# EAGLE schematic STM32f103 (EAGLE 9.5.1)

## Sheet 1 of 7: STM32F103C8TU
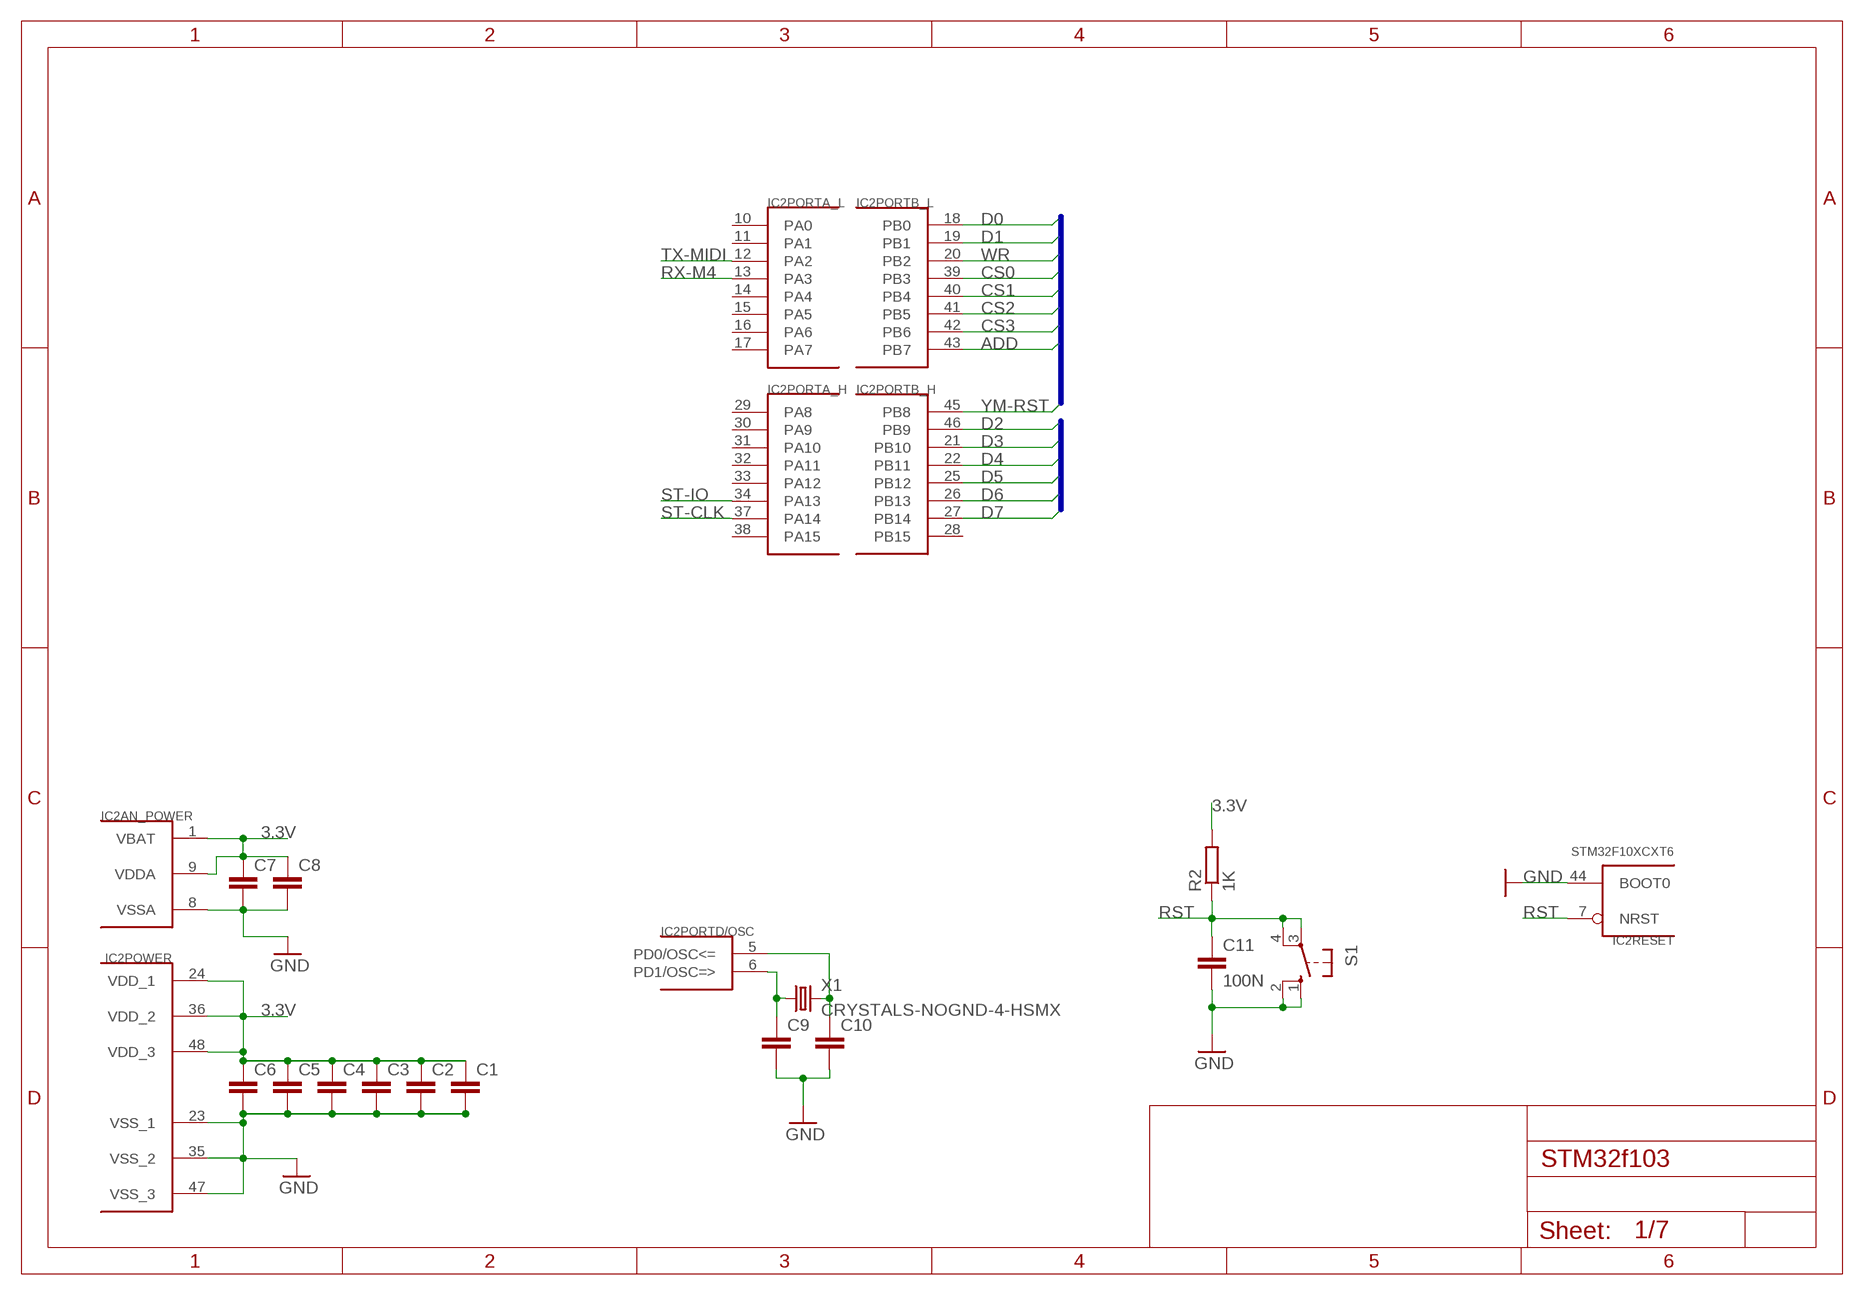
[diagram p0: schematic, sheet 1]

### Parts
C1  C-EUC0603  [C0603]
C2  C-EUC0603  [C0603]
C3  C-EUC0603  [C0603]
C4  C-EUC0603  [C0603]
C5  C-EUC0603  [C0603]
C6  C-EUC0603  [C0603]
C7  C-EUC0603  [C0603]
C8  C-EUC0603  [C0603]
C9  C-EUC0603  [C0603]
C10  C-EUC0603  [C0603]
C11  100N  [0603-SMD]
IC2  STM32F10XCXT6  [TQFP48]
R2  1K  [0805-SMD]
S1  10-XX  [B3F-10XX]
X1  CRYSTALS-NOGND-4-HSMX  [HC49-4-HSMX]

### Nets
3.3V: C1.1 C2.1 C3.1 C4.1 C5.1 C6.1 C7.1 C8.1 IC2.1(AN_POWER:VBAT) IC2.9(AN_POWER:VDDA) IC2.24(POWER:VDD_1) IC2.36(POWER:VDD_2) IC2.48(POWER:VDD_3) R2.2 ; also sheet 6
ADD: IC2.43(PORTB_L:PB7) ; also sheet 2,3,4,5
CS0: IC2.39(PORTB_L:PB3) ; also sheet 2
CS1: IC2.40(PORTB_L:PB4) ; also sheet 3
CS2: IC2.41(PORTB_L:PB5) ; also sheet 4
CS3: IC2.42(PORTB_L:PB6) ; also sheet 5
D0: IC2.18(PORTB_L:PB0) ; also sheet 2,3,4,5
D1: IC2.19(PORTB_L:PB1) ; also sheet 2,3,4,5
D2: IC2.46(PORTB_H:PB9) ; also sheet 2,3,4,5
D3: IC2.21(PORTB_H:PB10) ; also sheet 2,3,4,5
D4: IC2.22(PORTB_H:PB11) ; also sheet 2,3,4,5
D5: IC2.25(PORTB_H:PB12) ; also sheet 2,3,4,5
D6: IC2.26(PORTB_H:PB13) ; also sheet 2,3,4,5
D7: IC2.27(PORTB_H:PB14) ; also sheet 2,3,4,5
GND: C1.2 C2.2 C3.2 C4.2 C5.2 C6.2 C7.2 C8.2 C9.2 C10.2 C11.2 IC2.8(AN_POWER:VSSA) IC2.23(POWER:VSS_1) IC2.35(POWER:VSS_2) IC2.44(RESET:BOOT0) IC2.47(POWER:VSS_3) S1.1(S) S1.2(S1) ; also sheet 2,3,4,5,6
N$1: C9.1 IC2.6(PORTD/OSC:PD1/OSC=>) X1.1
N$2: C10.1 IC2.5(PORTD/OSC:PD0/OSC<=) X1.2
RST: C11.1 IC2.7(RESET:NRST) R2.1 S1.3(P) S1.4(P1)
RX-M4: IC2.13(PORTA_L:PA3)
ST-CLK: IC2.37(PORTA_H:PA14)
ST-IO: IC2.34(PORTA_H:PA13)
TX-MIDI: IC2.12(PORTA_L:PA2)
WR: IC2.20(PORTB_L:PB2) ; also sheet 2,3,4,5
YM-RST: IC2.45(PORTB_H:PB8) ; also sheet 2,3,4,5
Unconnected: IC2.2(PORTC:PC13) IC2.3(PORTC:PC14) IC2.4(PORTC:PC15) IC2.10(PORTA_L:PA0) IC2.11(PORTA_L:PA1) IC2.14(PORTA_L:PA4) IC2.15(PORTA_L:PA5) IC2.16(PORTA_L:PA6) IC2.17(PORTA_L:PA7) IC2.28(PORTB_H:PB15) IC2.29(PORTA_H:PA8) IC2.30(PORTA_H:PA9) IC2.31(PORTA_H:PA10) IC2.32(PORTA_H:PA11) IC2.33(PORTA_H:PA12) IC2.38(PORTA_H:PA15)

### Buses
ADD,CS0,CS1,CS2,CS3,D0,D1,WR,YM-RST
B$2

## Sheet 2 of 7: YM3812-0
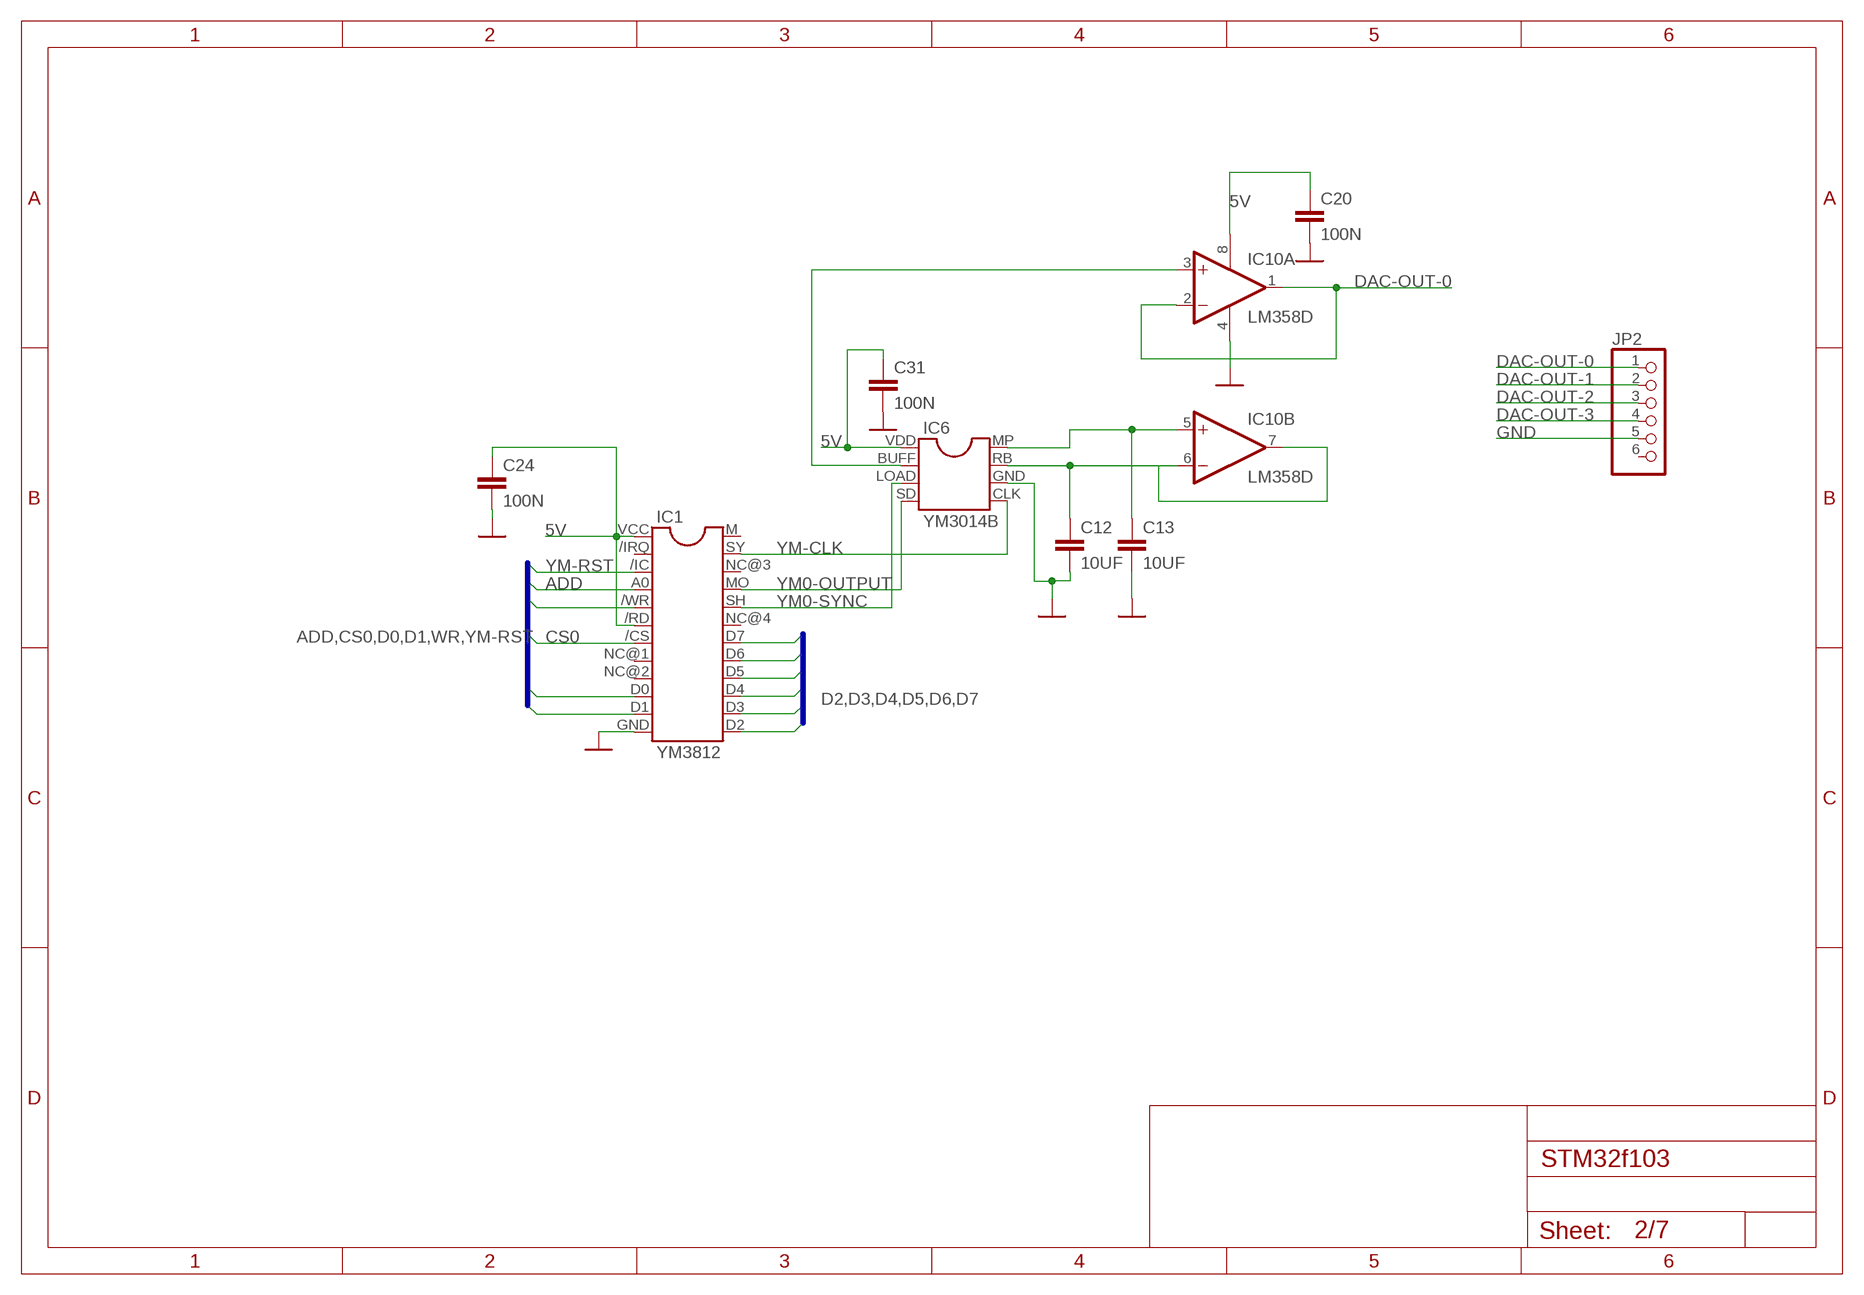
[diagram p1: schematic, sheet 2]

### Parts
C12  10UF  [0603-SMD]
C13  10UF  [0603-SMD]
C20  100N  [0603-SMD]
C24  100N  [0603-SMD]
C31  100N  [0603-SMD]
IC1  YM3812  [YM3812]
IC6  YM3014B  [YM3014B]
IC10  LM358D  [SO08]
JP2  PINHD-1X6  [1X06]

### Nets
5V: C20.1 C24.1 C31.1 IC1./RD IC1.VCC IC6.VDD IC10.8(P:V+) ; also sheet 3,4,5,6
ADD: IC1.A0 ; also sheet 1,3,4,5
CS0: IC1./CS ; also sheet 1
D0: IC1.D0 ; also sheet 1,3,4,5
D1: IC1.D1 ; also sheet 1,3,4,5
D2: IC1.D2 ; also sheet 1,3,4,5
D3: IC1.D3 ; also sheet 1,3,4,5
D4: IC1.D4 ; also sheet 1,3,4,5
D5: IC1.D5 ; also sheet 1,3,4,5
D6: IC1.D6 ; also sheet 1,3,4,5
D7: IC1.D7 ; also sheet 1,3,4,5
DAC-OUT-0: IC10.1(A:OUT) IC10.2(A:-IN) JP2.1
DAC-OUT-1: JP2.2 ; also sheet 3
DAC-OUT-2: JP2.3 ; also sheet 4
DAC-OUT-3: JP2.4 ; also sheet 5
GND: C12.2 C13.2 C20.2 C24.2 C31.2 IC1.GND IC6.GND IC10.4(P:V-) JP2.5 ; also sheet 1,3,4,5,6
N$3: IC6.BUFF IC10.3(A:+IN)
N$4: C13.1 IC6.MP IC10.5(B:+IN)
N$5: C12.1 IC6.RB IC10.6(B:-IN) IC10.7(B:OUT)
WR: IC1./WR ; also sheet 1,3,4,5
YM0-OUTPUT: IC1.MO IC6.SD
YM0-SYNC: IC1.SH IC6.LOAD
YM-CLK: IC1.SY IC6.CLK ; also sheet 3,4,5
YM-RST: IC1./IC ; also sheet 1,3,4,5
Unconnected: IC1./IRQ IC1.M IC1.NC@1(NC) IC1.NC@2(NC) IC1.NC@3(NC) IC1.NC@4(NC) JP2.6

### Buses
ADD,CS0,D0,D1,WR,YM-RST
D2,D3,D4,D5,D6,D7

## Sheet 3 of 7: YM3812-1
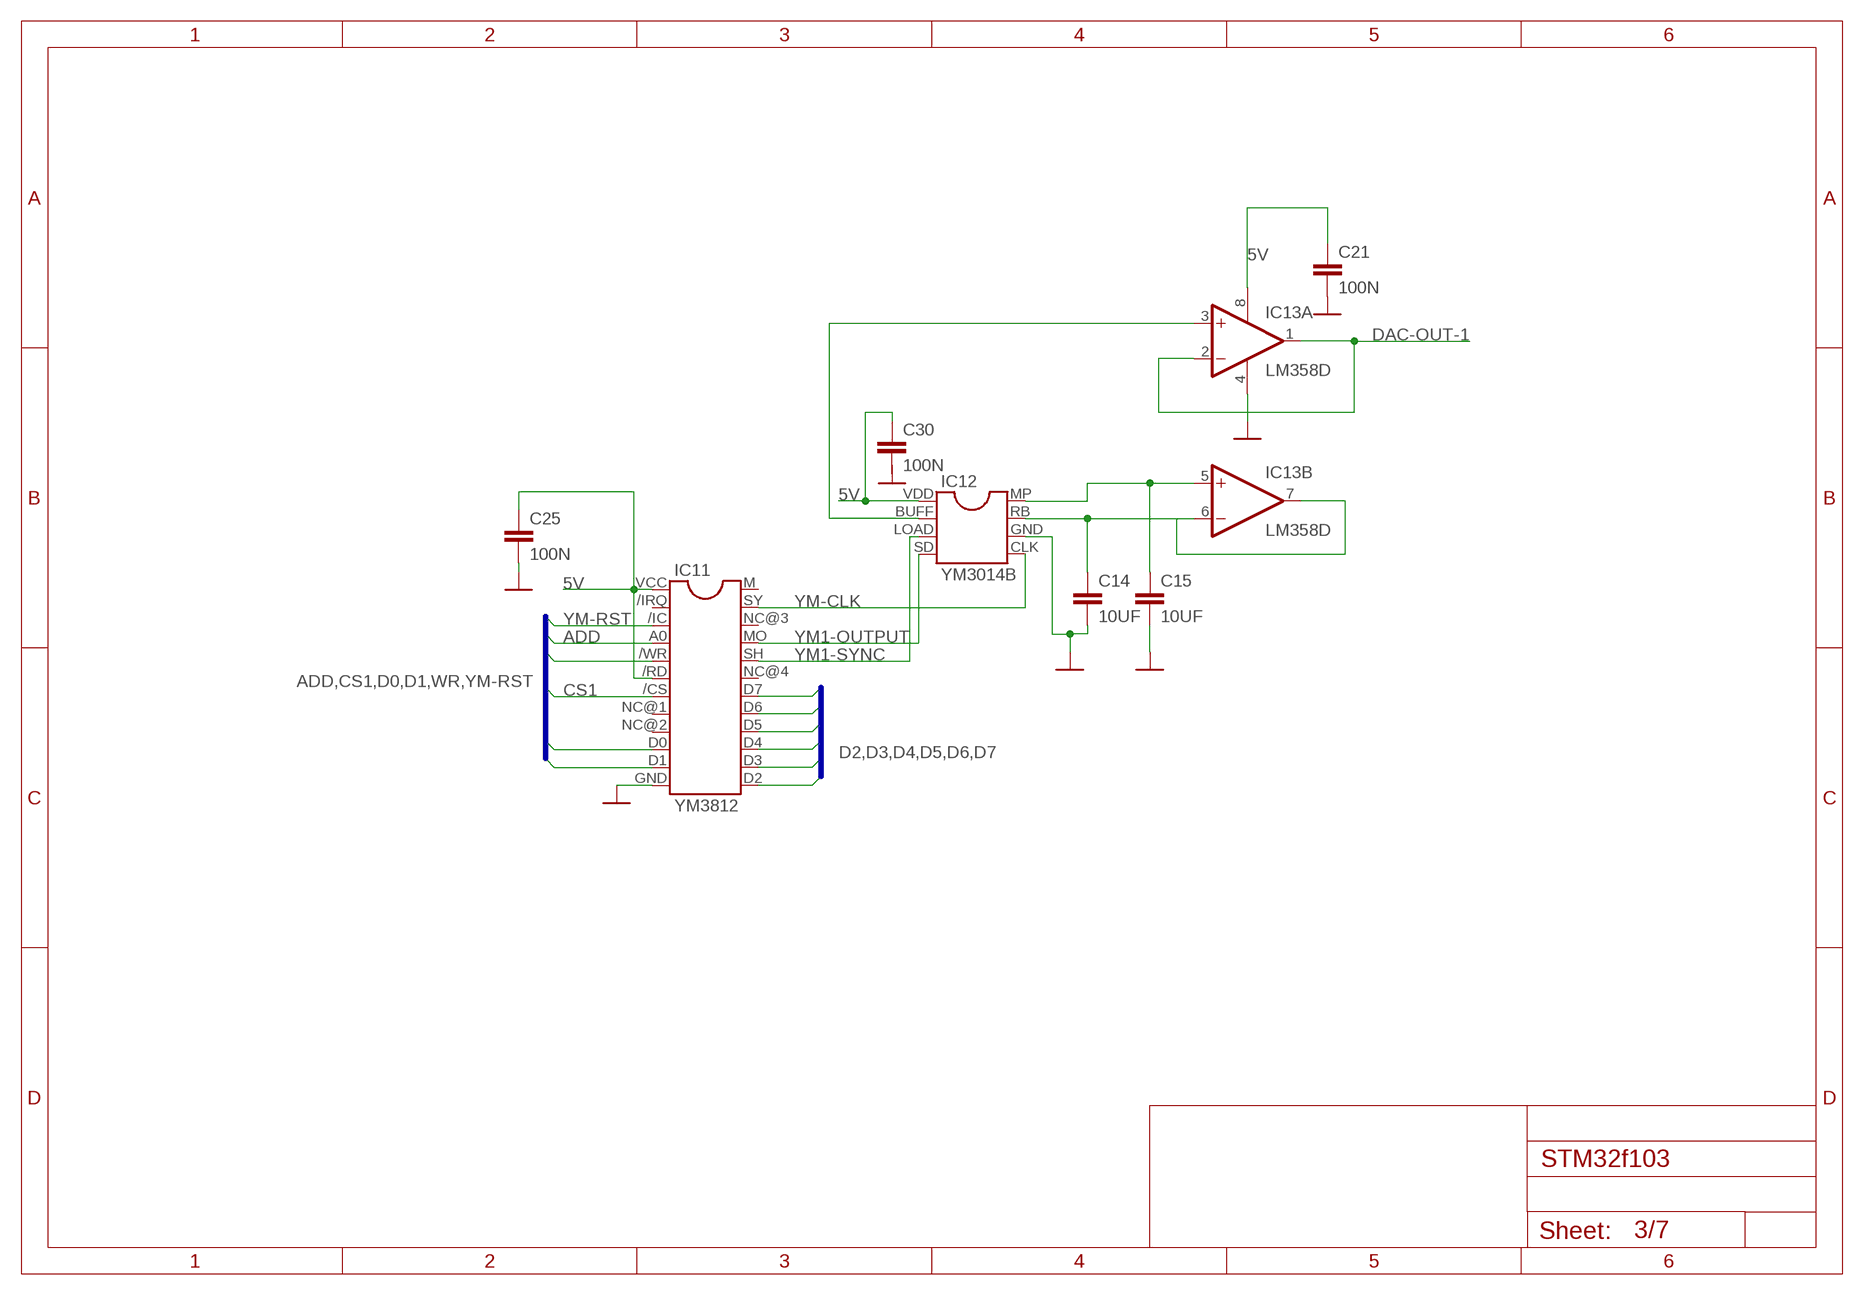
[diagram p2: schematic, sheet 3]

### Parts
C14  10UF  [0603-SMD]
C15  10UF  [0603-SMD]
C21  100N  [0603-SMD]
C25  100N  [0603-SMD]
C30  100N  [0603-SMD]
IC11  YM3812  [YM3812]
IC12  YM3014B  [YM3014B]
IC13  LM358D  [SO08]

### Nets
5V: C21.1 C25.1 C30.1 IC11./RD IC11.VCC IC12.VDD IC13.8(P:V+) ; also sheet 2,4,5,6
ADD: IC11.A0 ; also sheet 1,2,4,5
CS1: IC11./CS ; also sheet 1
D0: IC11.D0 ; also sheet 1,2,4,5
D1: IC11.D1 ; also sheet 1,2,4,5
D2: IC11.D2 ; also sheet 1,2,4,5
D3: IC11.D3 ; also sheet 1,2,4,5
D4: IC11.D4 ; also sheet 1,2,4,5
D5: IC11.D5 ; also sheet 1,2,4,5
D6: IC11.D6 ; also sheet 1,2,4,5
D7: IC11.D7 ; also sheet 1,2,4,5
DAC-OUT-1: IC13.1(A:OUT) IC13.2(A:-IN) ; also sheet 2
GND: C14.2 C15.2 C21.2 C25.2 IC11.GND IC12.GND IC13.4(P:V-) ; also sheet 1,2,4,5,6
N$6: IC12.BUFF IC13.3(A:+IN)
N$7: C15.1 IC12.MP IC13.5(B:+IN)
N$8: C14.1 IC12.RB IC13.6(B:-IN) IC13.7(B:OUT)
WR: IC11./WR ; also sheet 1,2,4,5
YM1-OUTPUT: IC11.MO IC12.SD
YM1-SYNC: IC11.SH IC12.LOAD
YM-CLK: IC11.SY IC12.CLK ; also sheet 2,4,5
YM-RST: IC11./IC ; also sheet 1,2,4,5
Unconnected: C30.2 IC11./IRQ IC11.M IC11.NC@1(NC) IC11.NC@2(NC) IC11.NC@3(NC) IC11.NC@4(NC)

### Buses
D2,D3,D4,D5,D6,D7
ADD,CS1,D0,D1,WR,YM-RST

## Sheet 4 of 7: YM3812-2
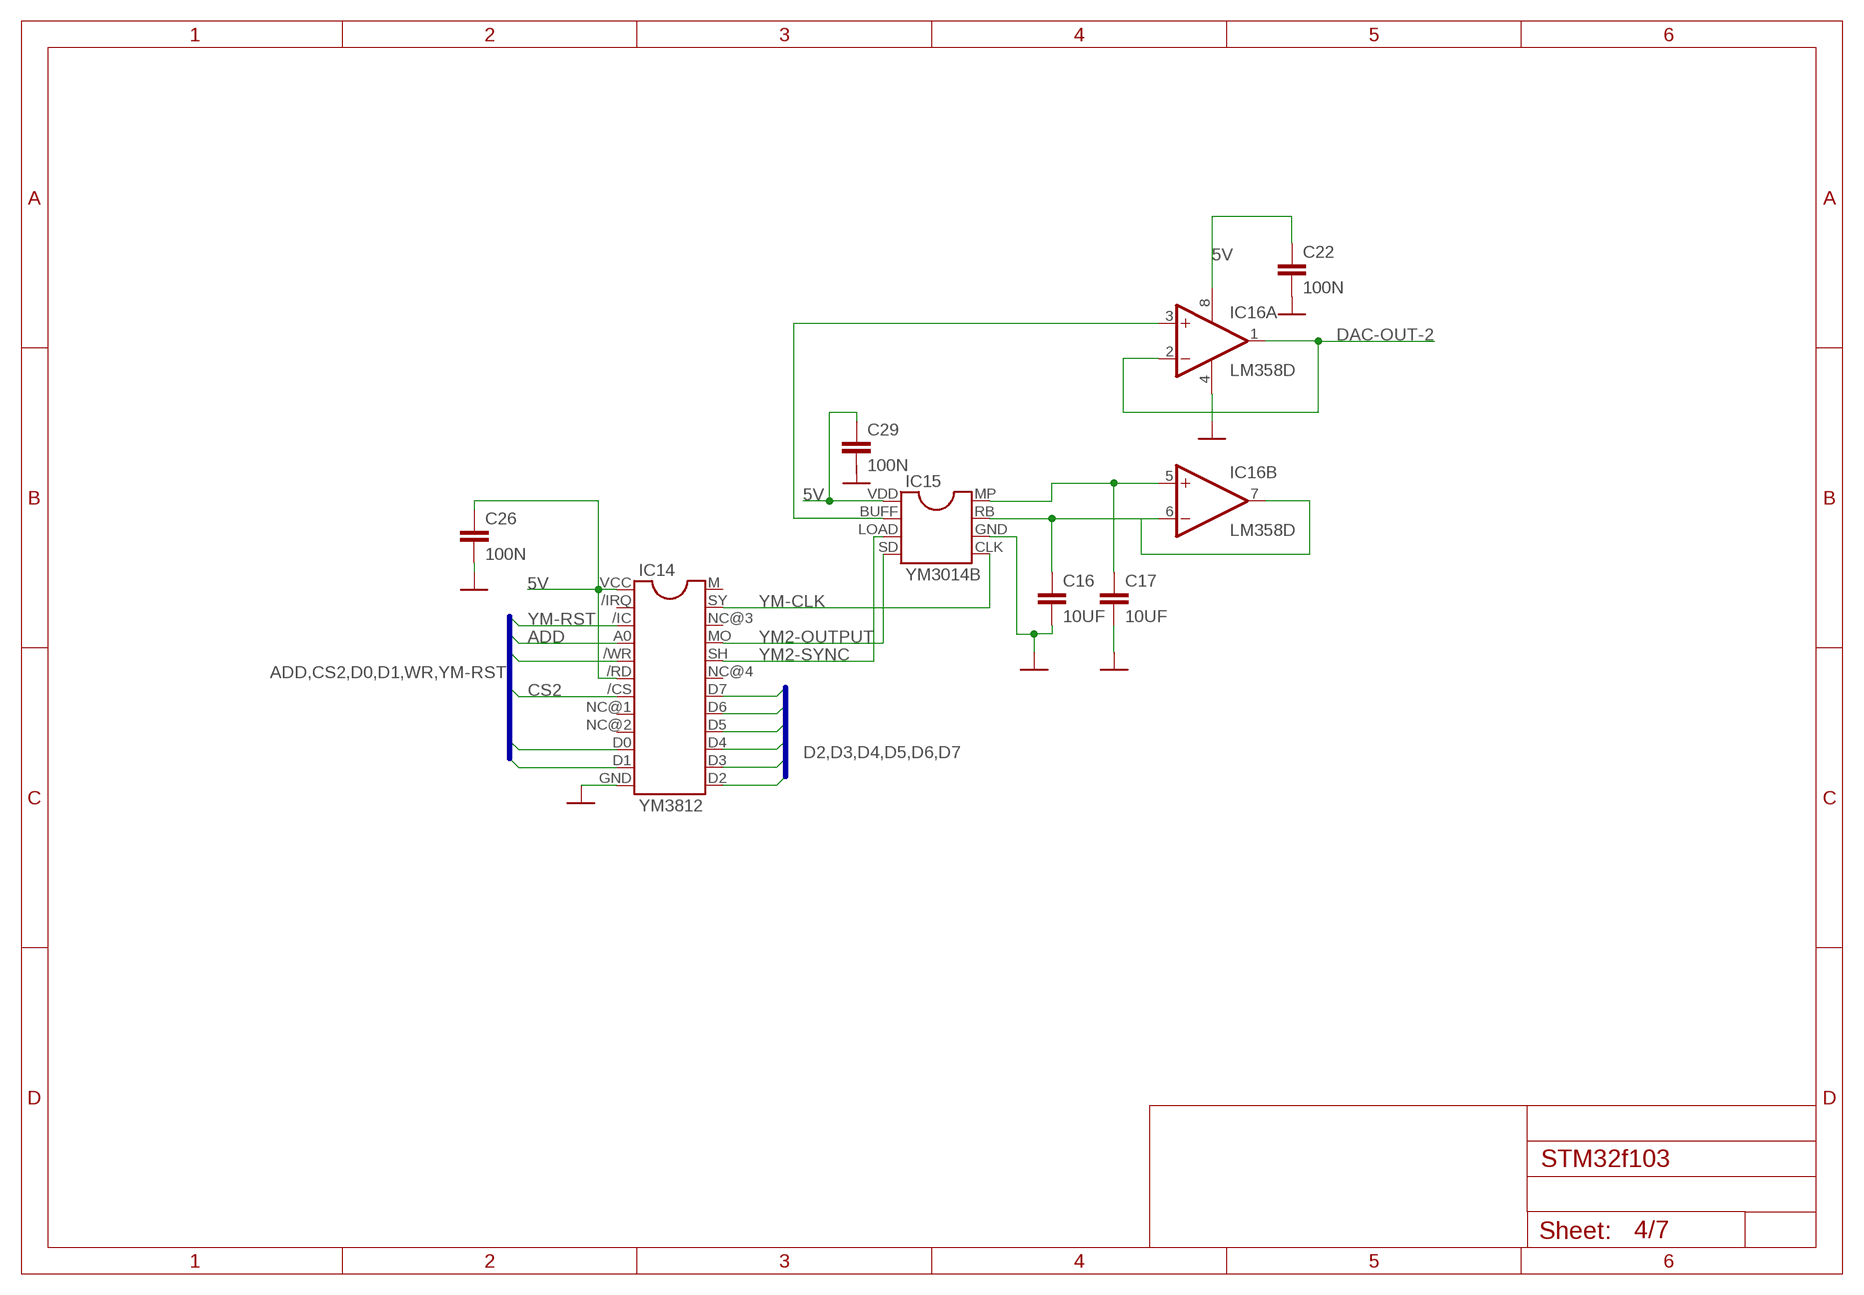
[diagram p3: schematic, sheet 4]

### Parts
C16  10UF  [0603-SMD]
C17  10UF  [0603-SMD]
C22  100N  [0603-SMD]
C26  100N  [0603-SMD]
C29  100N  [0603-SMD]
IC14  YM3812  [YM3812]
IC15  YM3014B  [YM3014B]
IC16  LM358D  [SO08]

### Nets
5V: C22.1 C26.1 C29.1 IC14./RD IC14.VCC IC15.VDD IC16.8(P:V+) ; also sheet 2,3,5,6
ADD: IC14.A0 ; also sheet 1,2,3,5
CS2: IC14./CS ; also sheet 1
D0: IC14.D0 ; also sheet 1,2,3,5
D1: IC14.D1 ; also sheet 1,2,3,5
D2: IC14.D2 ; also sheet 1,2,3,5
D3: IC14.D3 ; also sheet 1,2,3,5
D4: IC14.D4 ; also sheet 1,2,3,5
D5: IC14.D5 ; also sheet 1,2,3,5
D6: IC14.D6 ; also sheet 1,2,3,5
D7: IC14.D7 ; also sheet 1,2,3,5
DAC-OUT-2: IC16.1(A:OUT) IC16.2(A:-IN) ; also sheet 2
GND: C16.2 C17.2 C22.2 C26.2 IC14.GND IC15.GND IC16.4(P:V-) ; also sheet 1,2,3,5,6
N$9: IC15.BUFF IC16.3(A:+IN)
N$10: C17.1 IC15.MP IC16.5(B:+IN)
N$11: C16.1 IC15.RB IC16.6(B:-IN) IC16.7(B:OUT)
WR: IC14./WR ; also sheet 1,2,3,5
YM2-OUTPUT: IC14.MO IC15.SD
YM2-SYNC: IC14.SH IC15.LOAD
YM-CLK: IC14.SY IC15.CLK ; also sheet 2,3,5
YM-RST: IC14./IC ; also sheet 1,2,3,5
Unconnected: C29.2 IC14./IRQ IC14.M IC14.NC@1(NC) IC14.NC@2(NC) IC14.NC@3(NC) IC14.NC@4(NC)

### Buses
D2,D3,D4,D5,D6,D7
ADD,CS2,D0,D1,WR,YM-RST

## Sheet 5 of 7: YM3812-3
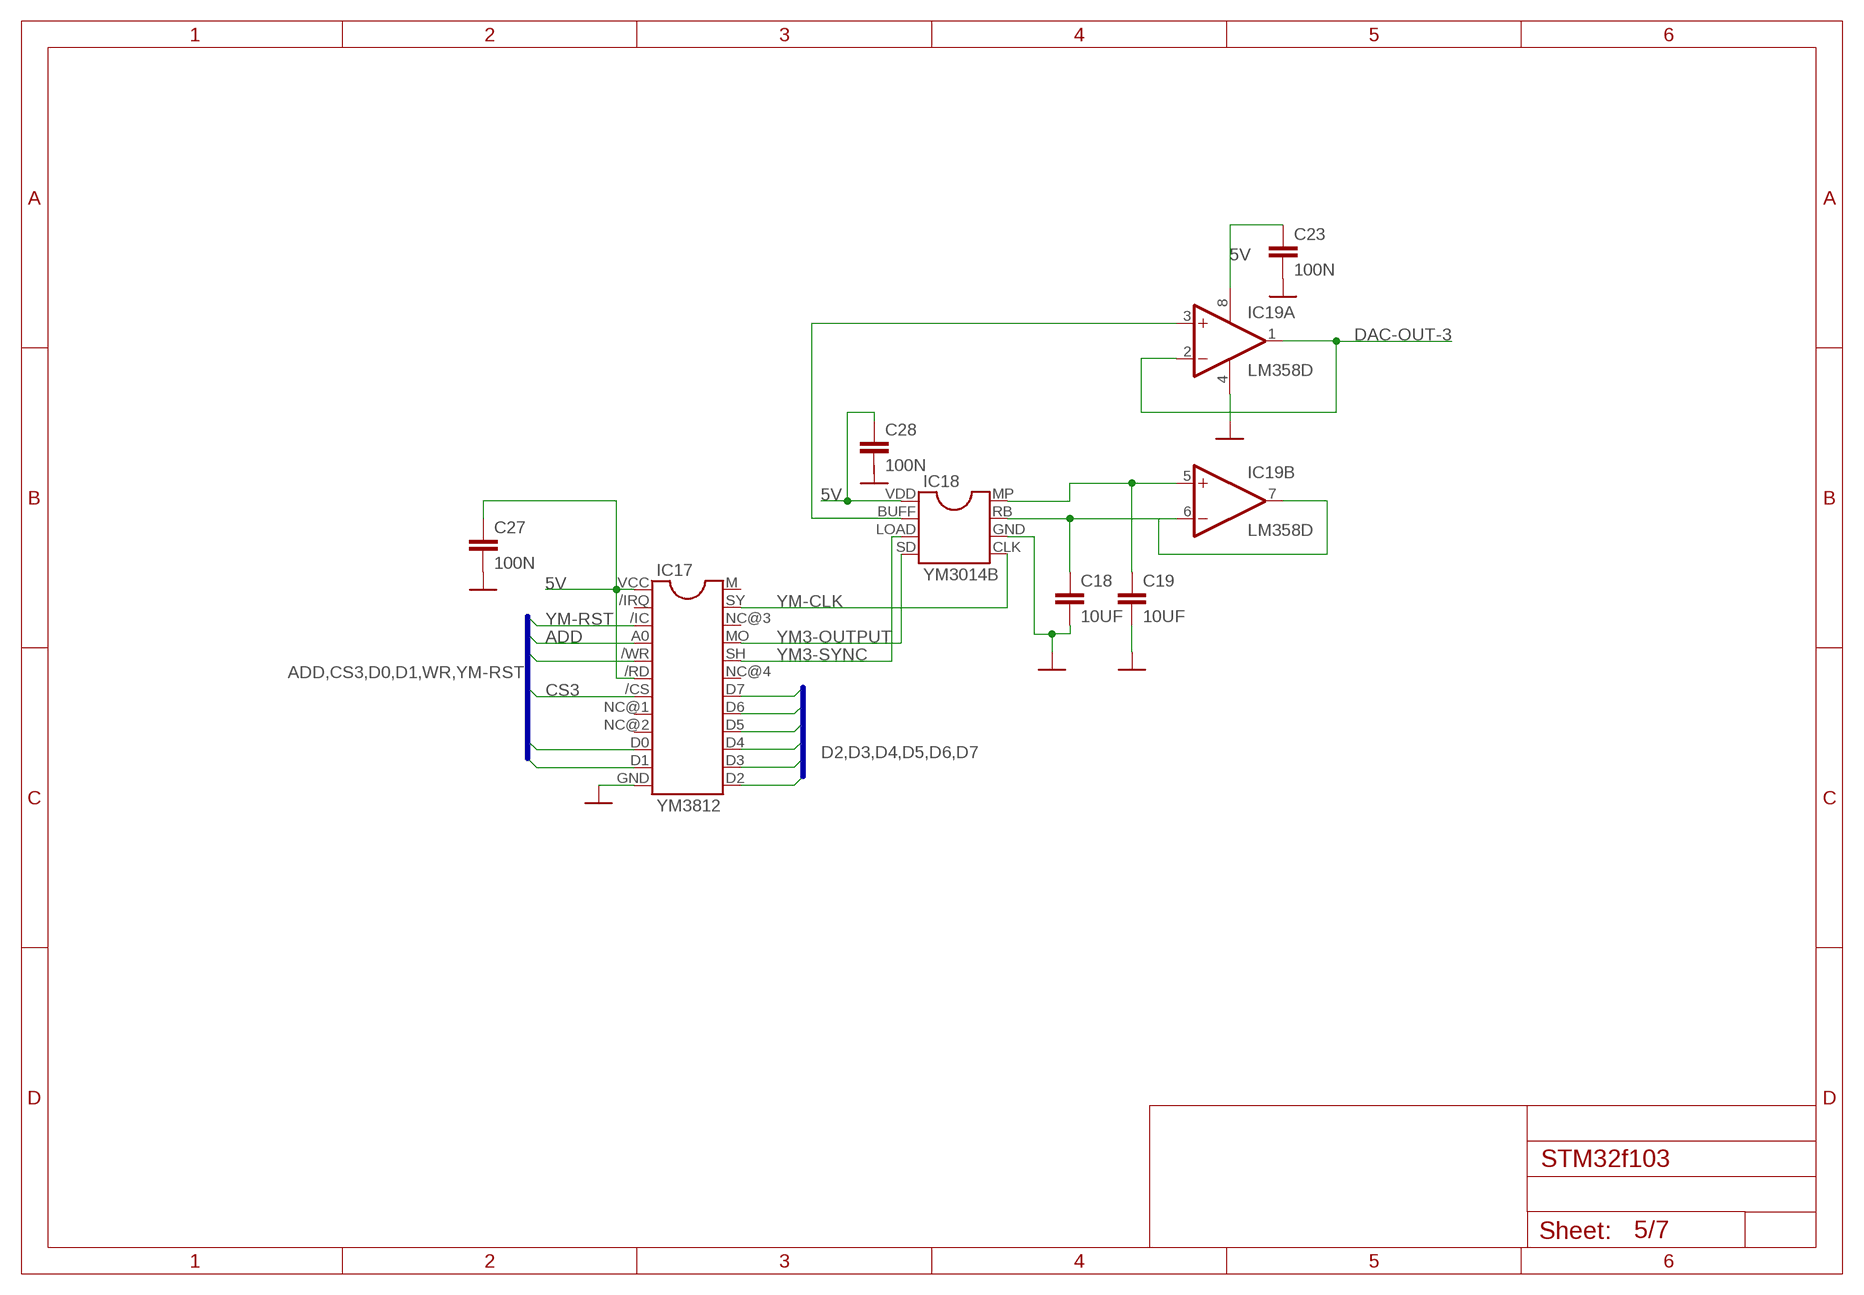
[diagram p4: schematic, sheet 5]

### Parts
C18  10UF  [0603-SMD]
C19  10UF  [0603-SMD]
C23  100N  [0603-SMD]
C27  100N  [0603-SMD]
C28  100N  [0603-SMD]
IC17  YM3812  [YM3812]
IC18  YM3014B  [YM3014B]
IC19  LM358D  [SO08]

### Nets
5V: C23.1 C27.1 C28.1 IC17./RD IC17.VCC IC18.VDD IC19.8(P:V+) ; also sheet 2,3,4,6
ADD: IC17.A0 ; also sheet 1,2,3,4
CS3: IC17./CS ; also sheet 1
D0: IC17.D0 ; also sheet 1,2,3,4
D1: IC17.D1 ; also sheet 1,2,3,4
D2: IC17.D2 ; also sheet 1,2,3,4
D3: IC17.D3 ; also sheet 1,2,3,4
D4: IC17.D4 ; also sheet 1,2,3,4
D5: IC17.D5 ; also sheet 1,2,3,4
D6: IC17.D6 ; also sheet 1,2,3,4
D7: IC17.D7 ; also sheet 1,2,3,4
DAC-OUT-3: IC19.1(A:OUT) IC19.2(A:-IN) ; also sheet 2
GND: C18.2 C19.2 C23.2 C27.2 IC17.GND IC18.GND IC19.4(P:V-) ; also sheet 1,2,3,4,6
N$12: IC18.BUFF IC19.3(A:+IN)
N$13: C19.1 IC18.MP IC19.5(B:+IN)
N$14: C18.1 IC18.RB IC19.6(B:-IN) IC19.7(B:OUT)
WR: IC17./WR ; also sheet 1,2,3,4
YM3-OUTPUT: IC17.MO IC18.SD
YM3-SYNC: IC17.SH IC18.LOAD
YM-CLK: IC17.SY IC18.CLK ; also sheet 2,3,4
YM-RST: IC17./IC ; also sheet 1,2,3,4
Unconnected: C28.2 IC17./IRQ IC17.M IC17.NC@1(NC) IC17.NC@2(NC) IC17.NC@3(NC) IC17.NC@4(NC)

### Buses
D2,D3,D4,D5,D6,D7
ADD,CS3,D0,D1,WR,YM-RST

## Sheet 6 of 7: POWER SUPPLY
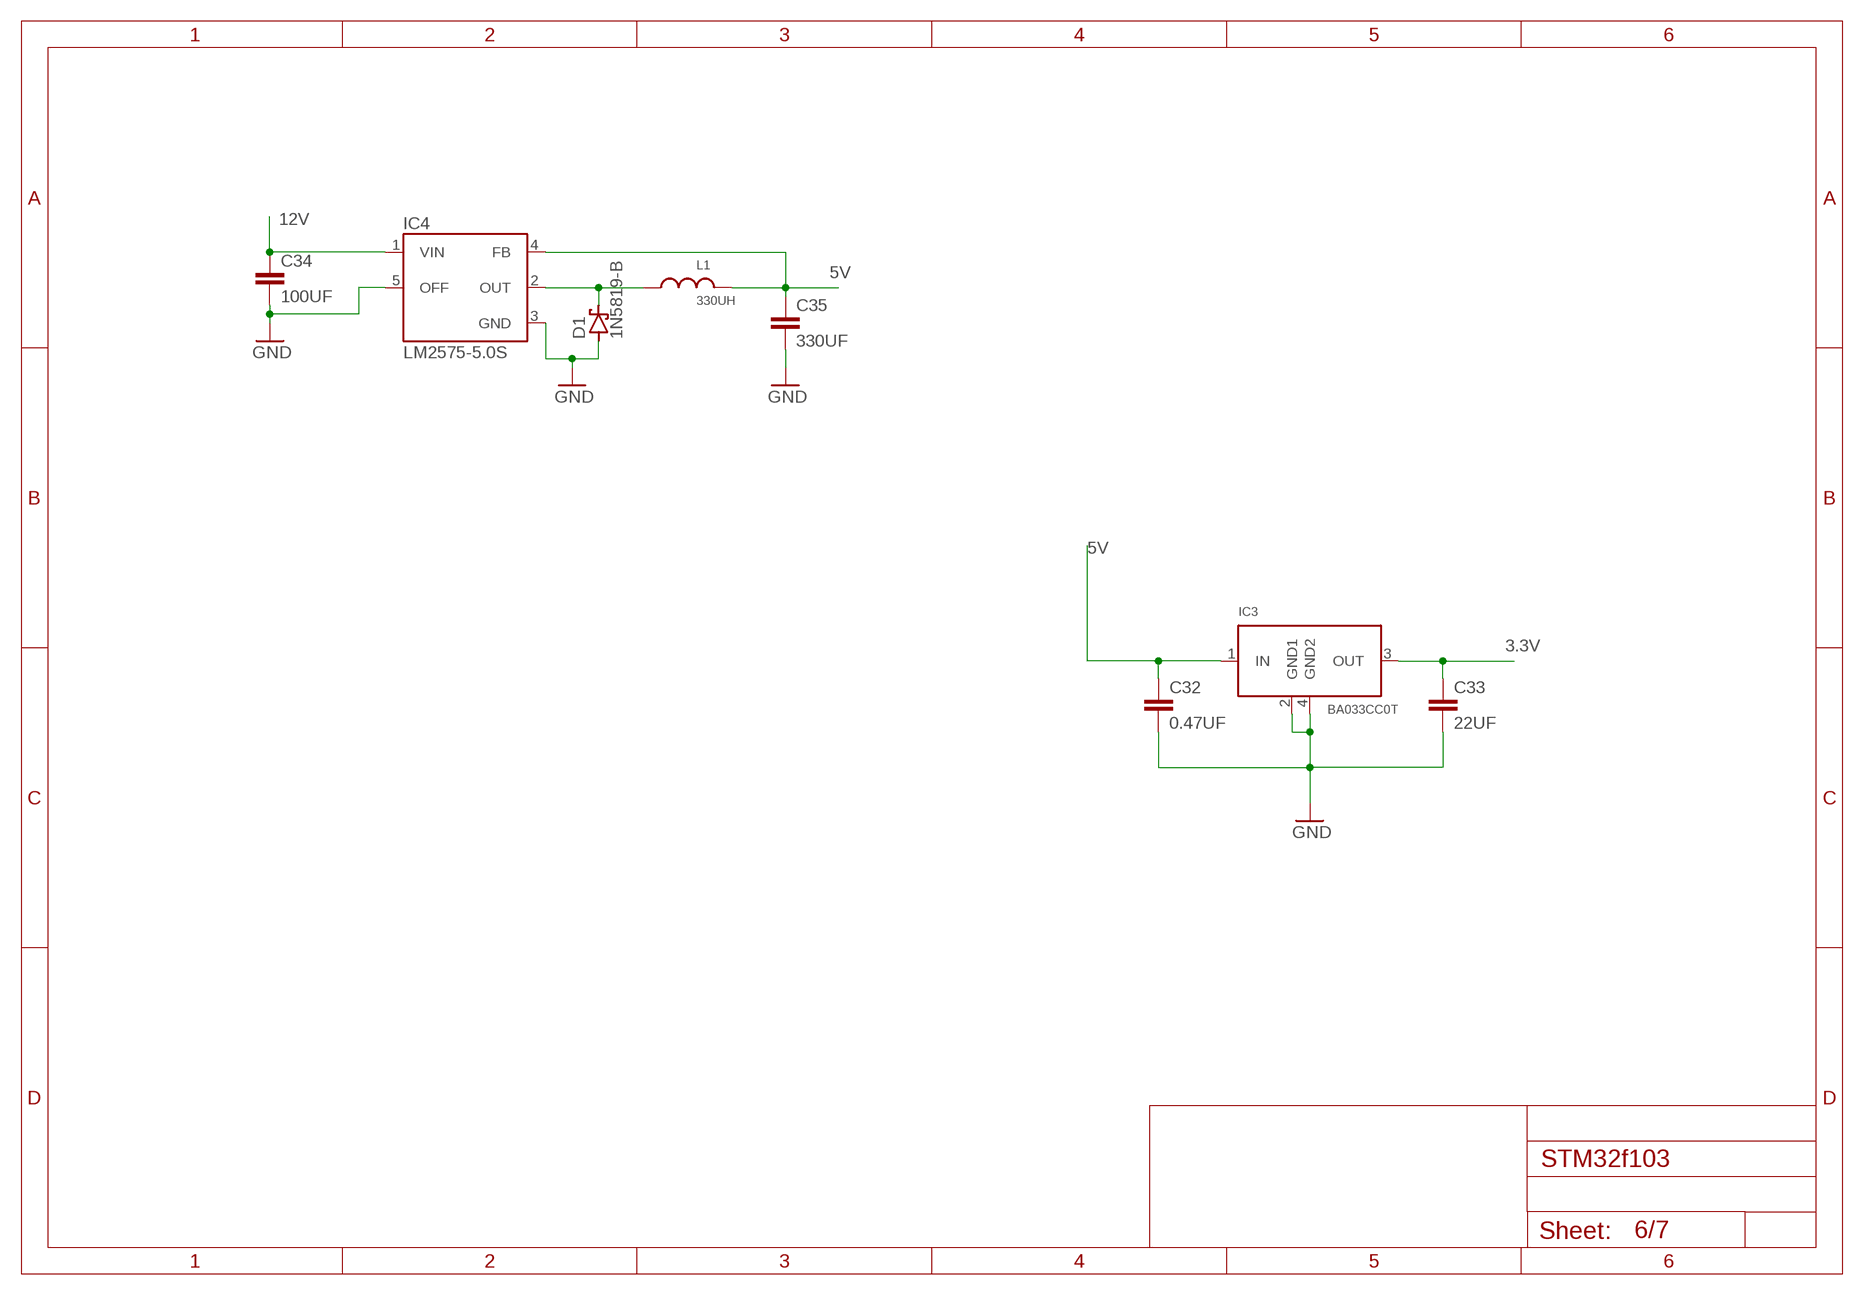
[diagram p5: schematic, sheet 6]

### Parts
C32  0.47UF  [0603-SMD]
C33  22UF  [0603-SMD]
C34  100UF  [0603-SMD]
C35  330UF  [0603-SMD]
D1  1N5819-B  [DO41-7.6]
IC3  BA033CC0T  VREG_MULTI  [SOT223]
IC4  LM2575-5.0S  [TO263-5]
L1  330UH  [0603-SMD]

### Nets
3.3V: C33.1 IC3.3(OUT) ; also sheet 1
5V: C32.1 C35.1 IC3.1(IN) IC4.4(FB) L1.1 ; also sheet 2,3,4,5
12V: C34.1 IC4.1(VIN)
GND: C32.2 C33.2 C34.2 C35.2 D1.A IC3.2(GND1) IC3.4(GND2) IC4.3(GND) IC4.5(OFF) ; also sheet 1,2,3,4,5
N$15: D1.C IC4.2(OUT) L1.2

## Sheet 7 of 7
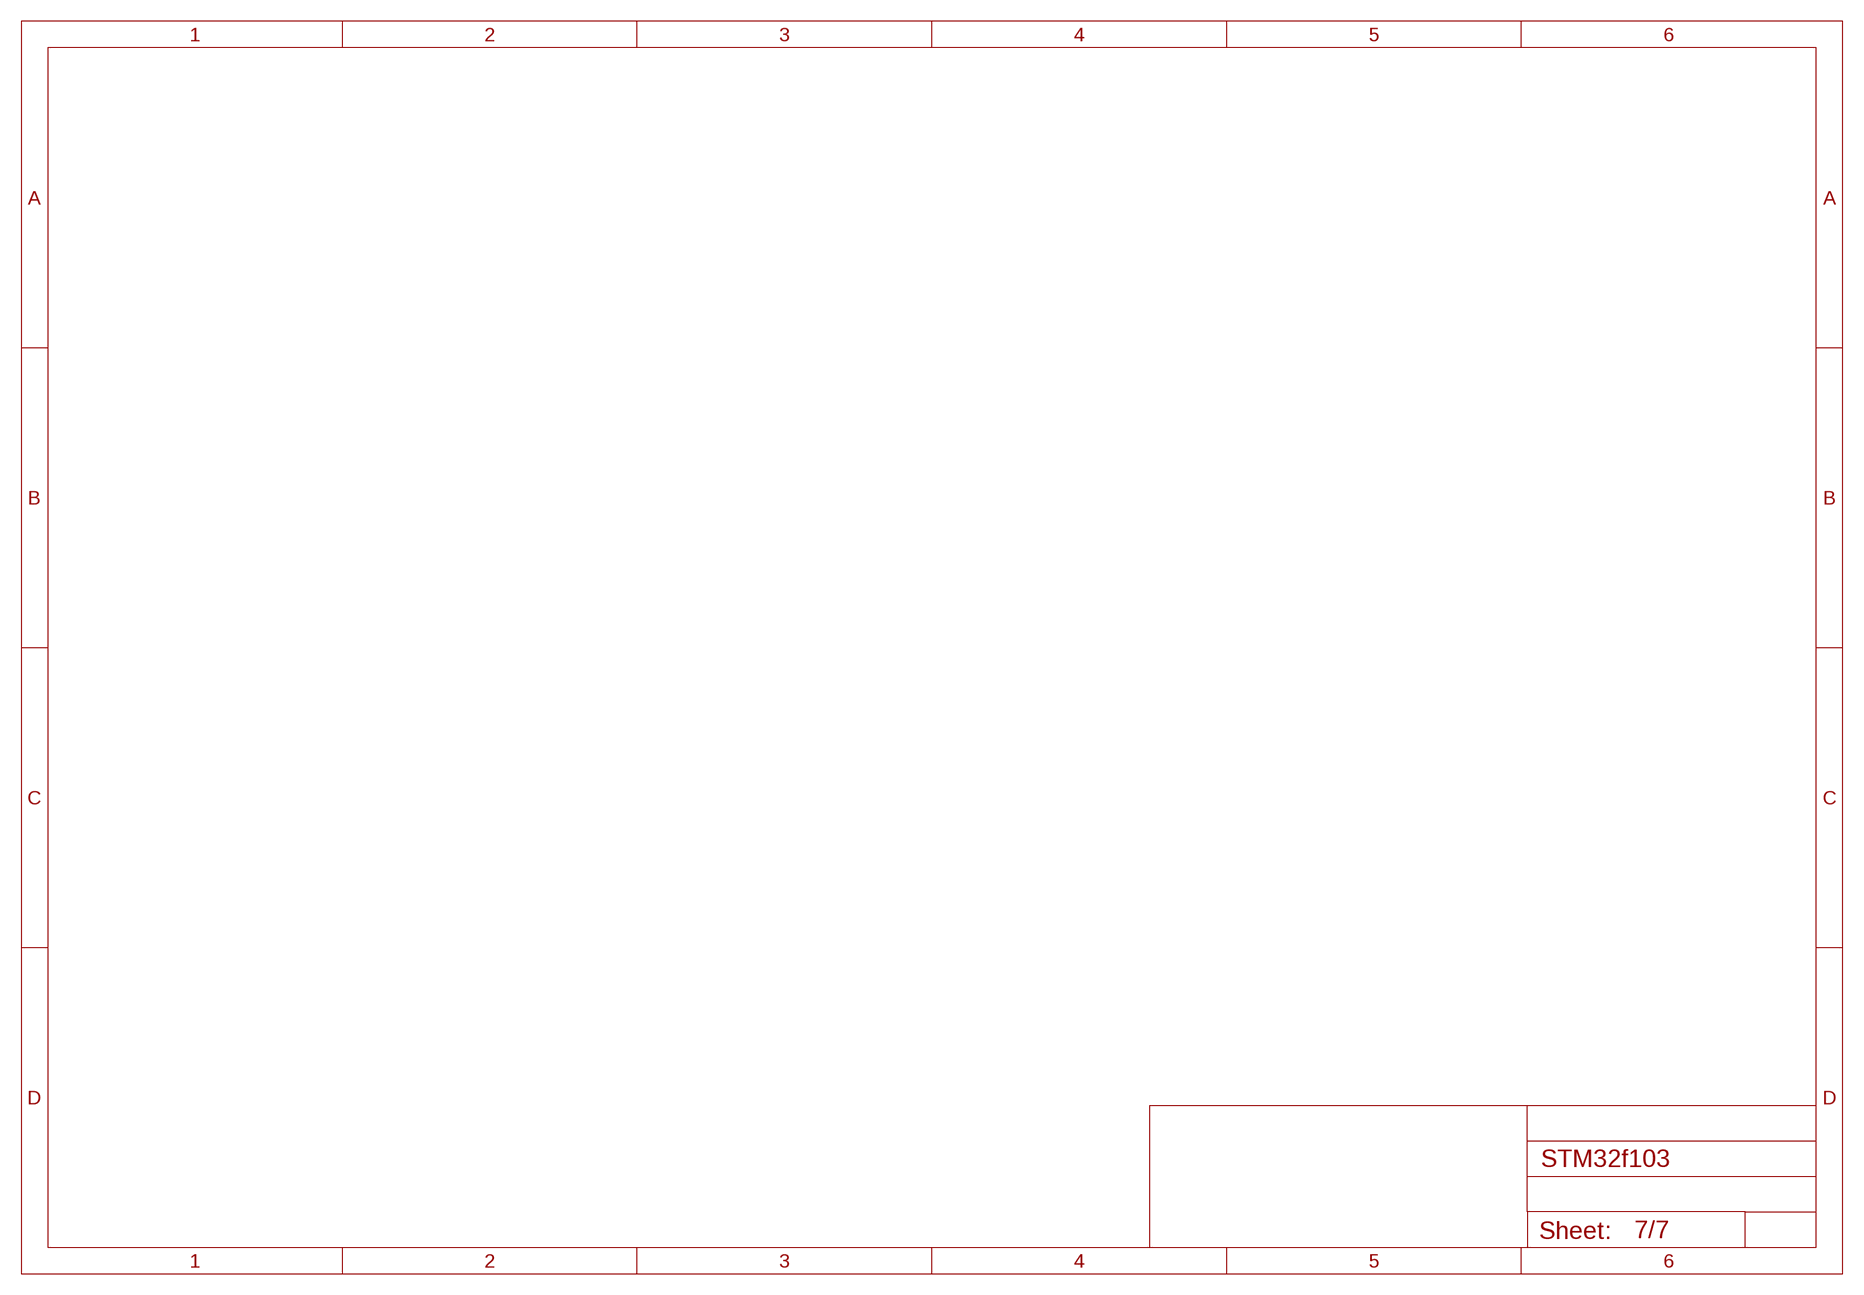
[diagram p6: schematic, sheet 7]

## Library data of the parts
C1-C10 = rcl:C-EU: CAPACITOR, European symbol; SPICEPREFIX: C
C11 C20-C31 = +HU-Lib:100N
C12-C19 = +HU-Lib:10UF
C32 = +HU-Lib:0.47UF
C33 = +HU-Lib:22UF
C34 = +HU-Lib:100UF
C35 = +HU-Lib:330UF
D1 = diode:1N581*: 1.0A SCHOTTKY BARRIER RECTIFIER Source: http://www.diodes.com/datasheets/ds23001.pdf
IC1 IC11 IC14 IC17 = YM:YM3812: Dual In Line
IC2 = stm32:STM32F10XCXT6: ST STM32F101/103 48pin LQFP
IC3 = LDO:VREG_MULTI: standard package voltage regulator (LM2940, LM2937, LM340, UA78M05, etc)
IC4 = lm2575:LM2575-5.0: National Semiconductor <http://www.national.com> 1.0A "Simple Switcher"(c) 52kHz, Vout 1.23-37V (HV: 57V), Vin 40V (HV: 60V), 50µA standby current
IC6 IC12 IC15 IC18 = YM:YM3014B: Dual In Line / Socket
IC10 IC13 IC16 IC19 = linear:LM358: OP AMP also LM158; LM258; LM2904 Source: http://cache.national.com/ds/LM/LM158.pdf
JP2 = adafruit:PINHD-1X6: PIN HEADER
L1 = +HU-Lib:330UH
R2 = +HU-Lib:1K
S1 = switch-omron:10-XX: OMRON SWITCH; MPN: B3F-1000; OC_FARNELL: 176432; OC_NEWARK: 36M3542
X1 = IQD-Frequency-Products:CRYSTALS-NOGND: CRYSTALS CAN NOT GROUNDED